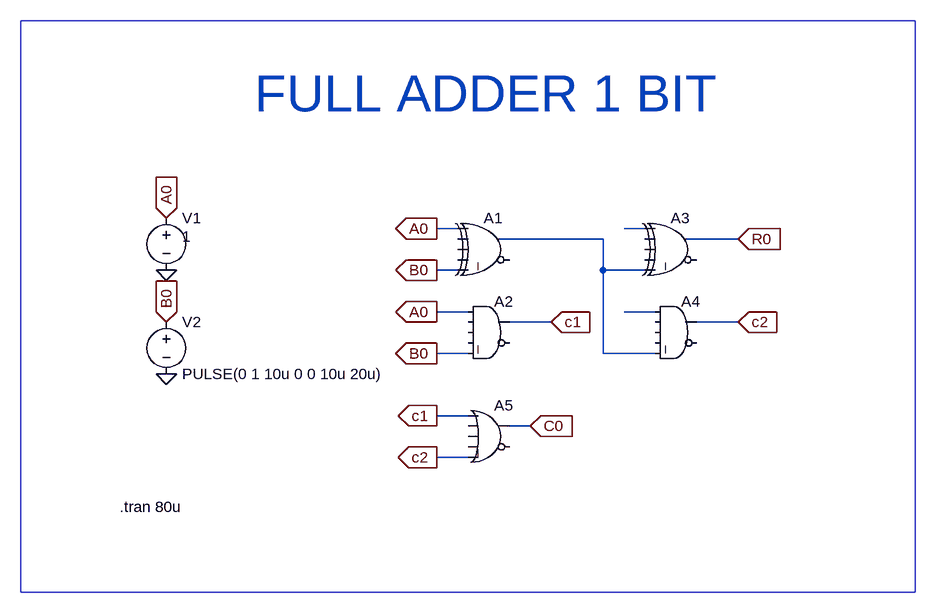
[diagram p0: schematic progetto_informatica_industriale.asc]
progetto_informatica_industriale.asc, the LTspice schematic file:
Version 4
SHEET 1 1208 680
WIRE 304 -48 272 -48
WIRE 592 -48 560 -48
WIRE 528 -32 368 -32
WIRE 736 -32 656 -32
WIRE 304 16 272 16
WIRE 528 16 528 -32
WIRE 592 16 528 16
WIRE 320 80 272 80
WIRE 608 80 560 80
WIRE 448 96 384 96
WIRE 736 96 672 96
WIRE 320 144 272 144
WIRE 528 144 528 16
WIRE 608 144 528 144
WIRE 320 240 272 240
WIRE 416 256 384 256
WIRE 320 304 272 304
FLAG 272 -48 A0
IOPIN 272 -48 Out
FLAG 272 16 B0
IOPIN 272 16 Out
FLAG 272 80 A0
IOPIN 272 80 Out
FLAG 272 144 B0
IOPIN 272 144 Out
FLAG 448 96 c1
IOPIN 448 96 In
FLAG 736 -32 R0
IOPIN 736 -32 In
FLAG 736 96 c2
IOPIN 736 96 In
FLAG 272 240 c1
IOPIN 272 240 Out
FLAG 272 304 c2
IOPIN 272 304 Out
FLAG 416 256 C0
IOPIN 416 256 In
FLAG -144 176 0
FLAG -144 16 0
FLAG -144 -64 A0
IOPIN -144 -64 In
FLAG -144 96 B0
IOPIN -144 96 In
SYMBOL Digital\\xor 352 -80 R0
SYMATTR InstName A1
SYMBOL Digital\\and 352 48 R0
SYMATTR InstName A2
SYMBOL Digital\\xor 640 -80 R0
SYMATTR InstName A3
SYMBOL Digital\\and 640 48 R0
SYMATTR InstName A4
SYMBOL Digital\\or 352 208 R0
SYMATTR InstName A5
SYMBOL voltage -144 -80 R0
WINDOW 3 24 44 Left 2
WINDOW 123 0 0 Left 0
WINDOW 39 0 0 Left 0
SYMATTR InstName V1
SYMATTR Value 1
SYMBOL voltage -144 80 R0
WINDOW 123 0 0 Left 0
WINDOW 39 0 0 Left 0
SYMATTR InstName V2
SYMATTR Value PULSE(0 1 10u 0 0 10u 20u)
TEXT -216 380 Left 2 !.tran 80u
TEXT -8 -256 Left 6 ;FULL ADDER 1 BIT
RECTANGLE Normal 1008 -368 -368 512

The netlist it stands for:
* progetto_informatica_industriale.asc
A1 A0 0 0 0 B0 0 N002 0 XOR
A2 A0 0 0 0 B0 0 c1 0 AND
A3 N001 0 0 0 N002 0 R0 0 XOR
A4 N003 0 0 0 N002 0 c2 0 AND
A5 c1 0 0 0 c2 0 C0 0 OR
V1 A0 0 1
V2 B0 0 PULSE(0 1 10u 0 0 10u 20u)
.tran 80u
* FULL ADDER 1 BIT
.backanno
.end